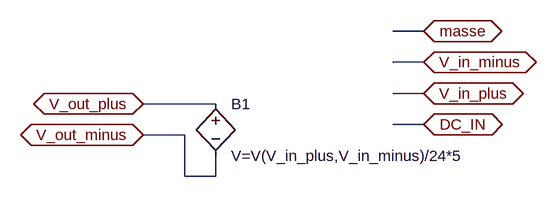
[diagram p0: schematic RDS33.asc]
RDS33.asc, the LTspice schematic file:
Version 4
SHEET 1 880 680
WIRE 304 96 256 96
WIRE 304 144 256 144
WIRE 304 192 256 192
WIRE -16 208 -128 208
WIRE 304 240 256 240
WIRE -64 256 -128 256
WIRE -64 320 -64 256
WIRE -16 320 -16 288
WIRE -16 320 -64 320
FLAG 304 96 masse
IOPIN 304 96 BiDir
FLAG 304 192 V_in_plus
IOPIN 304 192 BiDir
FLAG 304 144 V_in_minus
IOPIN 304 144 BiDir
FLAG 304 240 DC_IN
IOPIN 304 240 BiDir
FLAG -128 208 V_out_plus
IOPIN -128 208 BiDir
FLAG -128 256 V_out_minus
IOPIN -128 256 BiDir
SYMBOL bv -16 192 R0
SYMATTR InstName B1
SYMATTR Value V=V(V_in_plus,V_in_minus)/24*5

The netlist it stands for:
* RDS33.asc
B1 V_out_plus V_out_minus V=V(V_in_plus,V_in_minus)/24*5
.backanno
.end